# EAGLE design smartIndoor (EAGLE 9.5.2)

## Sheet 1 of 3
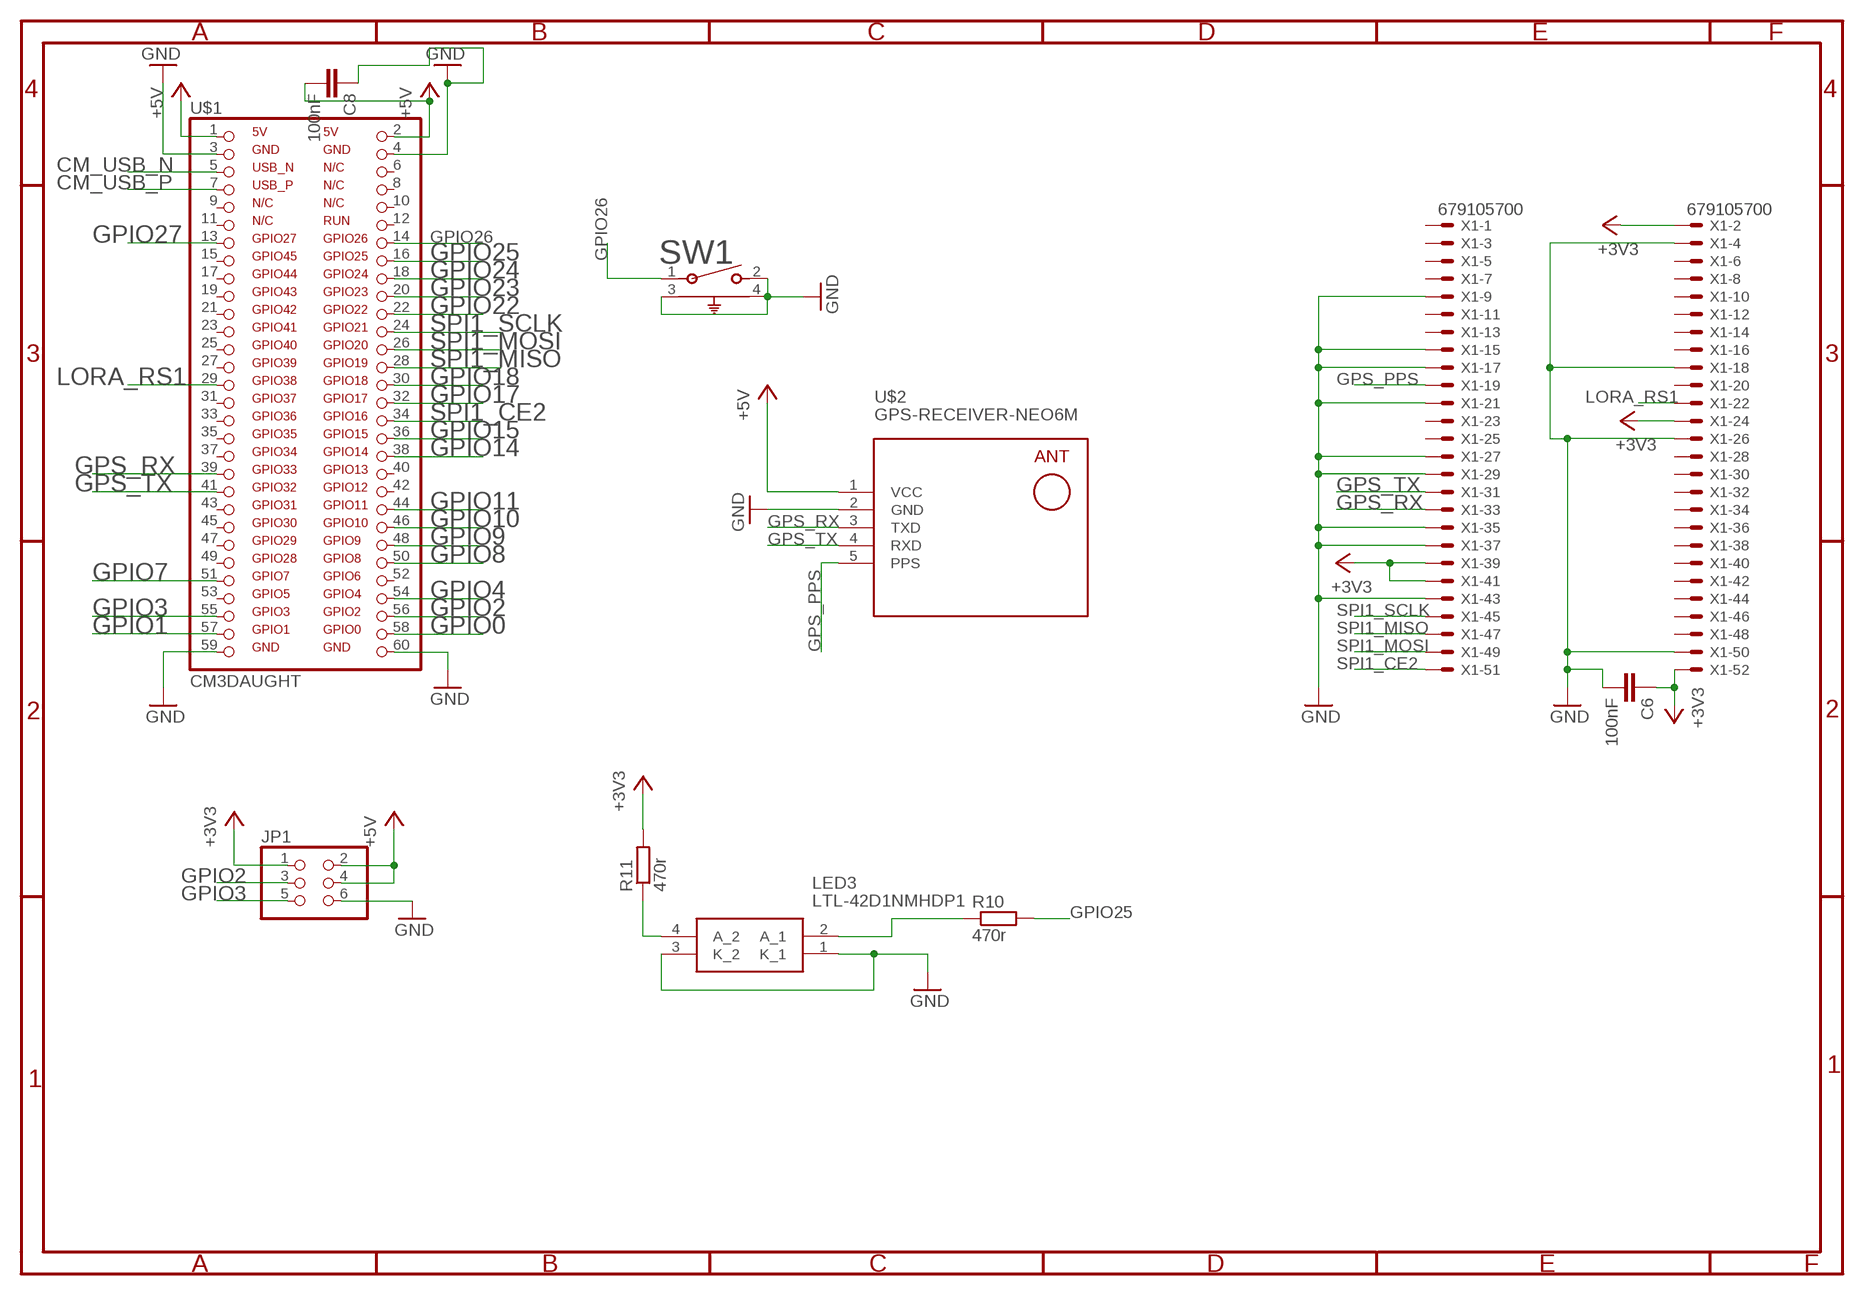
[diagram p0: schematic, sheet 1]

### Parts
C6  100nF  C-EUC0603  [C0603]
C8  100nF  C-EUC0603  [C0603]
JP1  PINHD-2X3  [2X03]
LED3  LTL-42D1NMHDP1  [LTL42D1NMHDP1]
R10  470r  R-EU_R0603  [R0603]
R11  470r  R-EU_R0603  [R0603]
SW1  1825027-8  [SW2_1825027-C_TEC]
U$1  CM3DAUGHT  [2X30]
U$2  GPS-RECEIVER-NEO6M  [GPS-RECEIVER-NEO6M]
X1  679105700  [679105700]

### Nets
+3V3: C6.1 JP1.1 R11.2 X1.2 X1.24 X1.39 X1.41 X1.52 ; also sheet 2
+5V: C8.2 JP1.2 JP1.4 U$1.1(5V) U$1.2(5V) U$2.1(VCC) ; also sheet 2,3
CM_USB_N: U$1.5(USB_N) ; also sheet 3
CM_USB_P: U$1.7(USB_P) ; also sheet 3
GND: C6.2 C8.1 JP1.6 LED3.1(K_1) LED3.3(K_2) SW1.2 SW1.3 SW1.4 U$1.3(GND) U$1.4(GND) U$1.59(GND) U$1.60(GND) U$2.2(GND) X1.4 X1.9 X1.15 X1.17 X1.18 X1.21 X1.26 X1.27 X1.29 X1.35 X1.37 X1.43 X1.50 ; also sheet 2,3
GPIO0: U$1.58(GPIO0)
GPIO1: U$1.57(GPIO1)
GPIO2: JP1.3 U$1.56(GPIO2)
GPIO3: JP1.5 U$1.55(GPIO3)
GPIO4: U$1.54(GPIO4)
GPIO7: U$1.51(GPIO7)
GPIO8: U$1.50(GPIO8)
GPIO9: U$1.48(GPIO9)
GPIO10: U$1.46(GPIO10)
GPIO11: U$1.44(GPIO11)
GPIO14: U$1.38(GPIO14)
GPIO15: U$1.36(GPIO15)
GPIO17: U$1.32(GPIO17)
GPIO18: U$1.30(GPIO18)
GPIO22: U$1.22(GPIO22)
GPIO23: U$1.20(GPIO23)
GPIO24: U$1.18(GPIO24)
GPIO25: R10.2 U$1.16(GPIO25)
GPIO26: SW1.1 U$1.14(GPIO26)
GPIO27: U$1.13(GPIO27)
GPS_PPS: U$2.5(PPS) X1.19
GPS_RX: U$1.39(GPIO33) U$2.3(TXD) X1.33
GPS_TX: U$1.41(GPIO32) U$2.4(RXD) X1.31
LORA_RS1: U$1.29(GPIO38) X1.22
N$6: LED3.4(A_2) R11.1
N$8: LED3.2(A_1) R10.1
SPI1_CE2: U$1.34(GPIO16) X1.51
SPI1_MISO: U$1.28(GPIO19) X1.47
SPI1_MOSI: U$1.26(GPIO20) X1.49
SPI1_SCLK: U$1.24(GPIO21) X1.45
Unconnected: U$1.6 U$1.8 U$1.9 U$1.10 U$1.11 U$1.12 U$1.15(GPIO45) U$1.17(GPIO44) U$1.19(GPIO43) U$1.21(GPIO42) U$1.23(GPIO41) U$1.25(GPIO40) U$1.27(GPIO39) U$1.31(GPIO37) U$1.33(GPIO36) U$1.35(GPIO35) U$1.37(GPIO34) U$1.40(GPIO13) U$1.42(GPIO12) U$1.43(GPIO31) U$1.45(GPIO30) U$1.47(GPIO29) U$1.49(GPIO28) U$1.52(GPIO6) U$1.53(GPIO5) X1.1 X1.3 X1.5 X1.6 X1.7 X1.8 X1.10 X1.11 X1.12 X1.13 X1.14 X1.16 X1.20 X1.23 X1.25 X1.28 X1.30 X1.32 X1.34 X1.36 X1.38 X1.40 X1.42 X1.44 X1.46 X1.48

## Sheet 2 of 3
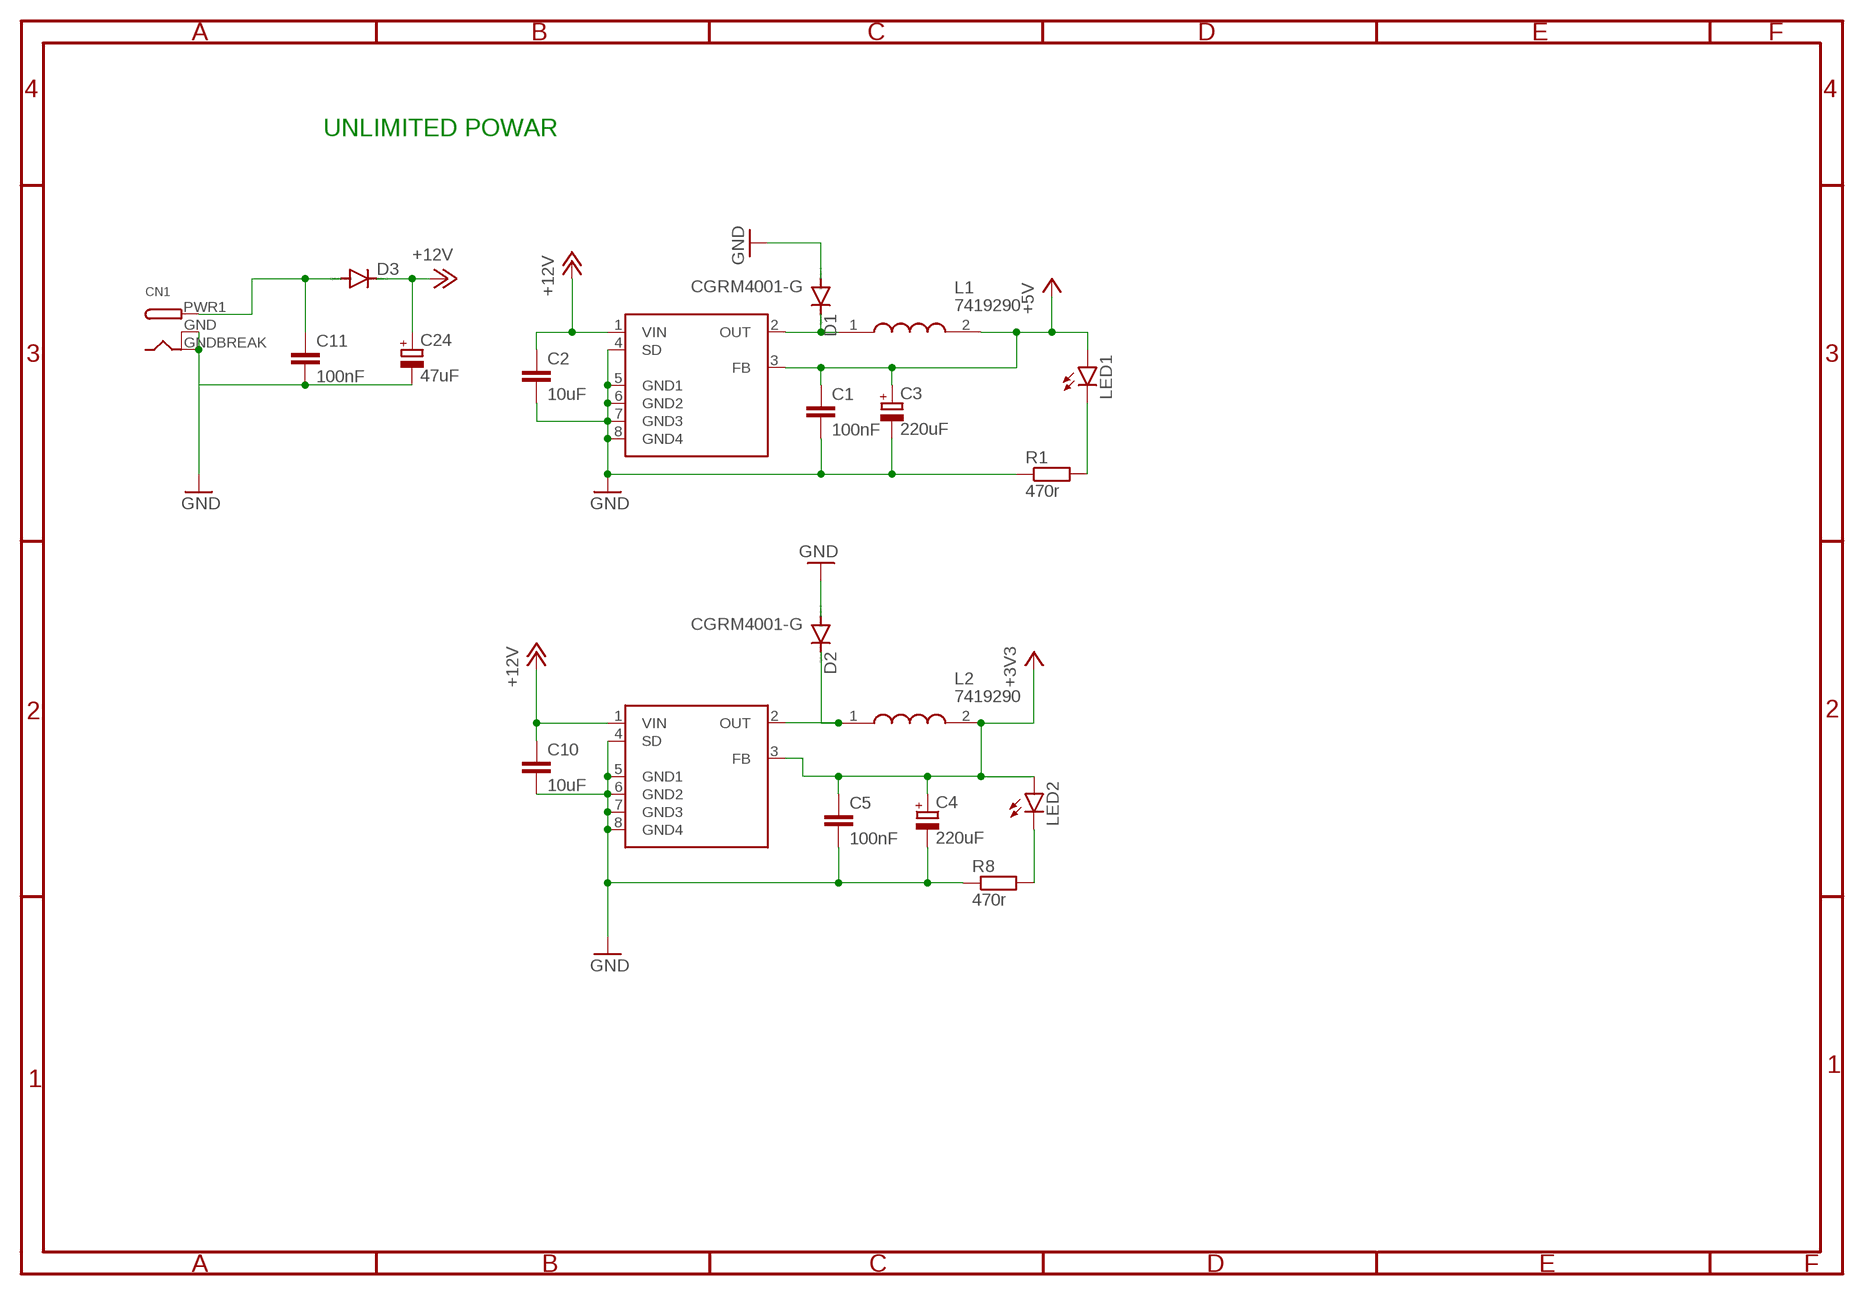
[diagram p1: schematic, sheet 2]

### Parts
C1  100nF  C-EUC0603  [C0603]
C2  10uF  C-EUC0603  [C0603]
C3  220uF  CPOL-EUD  [PANASONIC_D]
C4  220uF  CPOL-EUD  [PANASONIC_D]
C5  100nF  C-EUC0603  [C0603]
C10  10uF  C-EUC0603  [C0603]
C11  100nF  C-EUC0603  [C0603]
C24  47uF  CPOL-EUD  [PANASONIC_D]
CN1  DCBARRELSMT  [DCJACK_2MM_SMT]
D1  CGRM4001-G  [SOD-123_MINI-SMA]
D2  CGRM4001-G  [SOD-123_MINI-SMA]
D3  DIODE-SMB  [SMB]
L1  7419290  [INDPM115100X410N]
L2  7419290  [INDPM115100X410N]
LED1  LEDCHIP-LED0603  [CHIP-LED0603]
LED2  LEDCHIP-LED0603  [CHIP-LED0603]
R1  470r  R-EU_R0603  [R0603]
R8  470r  R-EU_R0603  [R0603]
U1  AP1509  [SO08]
U2  AP1509  [SO08]

### Nets
+3V3: C4.+ C5.1 L2.2 LED2.A U2.3(FB) ; also sheet 1
+5V: C1.1 C3.+ L1.2 LED1.A U1.3(FB) ; also sheet 1,3
+12V: C2.1 C10.1 C24.+ D3.C U1.1(VIN) U2.1(VIN)
GND: C1.2 C2.2 C3.- C4.- C5.2 C10.2 C11.2 C24.- CN1.GND(GNDBREAK) CN1.GNDBREAK(GND) D1.A D2.A R1.1 R8.1 U1.4(SD) U1.5(GND1) U1.6(GND2) U1.7(GND3) U1.8(GND4) U2.4(SD) U2.5(GND1) U2.6(GND2) U2.7(GND3) U2.8(GND4) ; also sheet 1,3
N$5: C11.1 CN1.PWR1(PWR) D3.A
N$7: LED1.C R1.2
N$10: D1.C L1.1 U1.2(OUT)
N$13: LED2.C R8.2
N$14: D2.C L2.1 U2.2(OUT)

### Notes on the sheet
- UNLIMITED POWAR

## Sheet 3 of 3
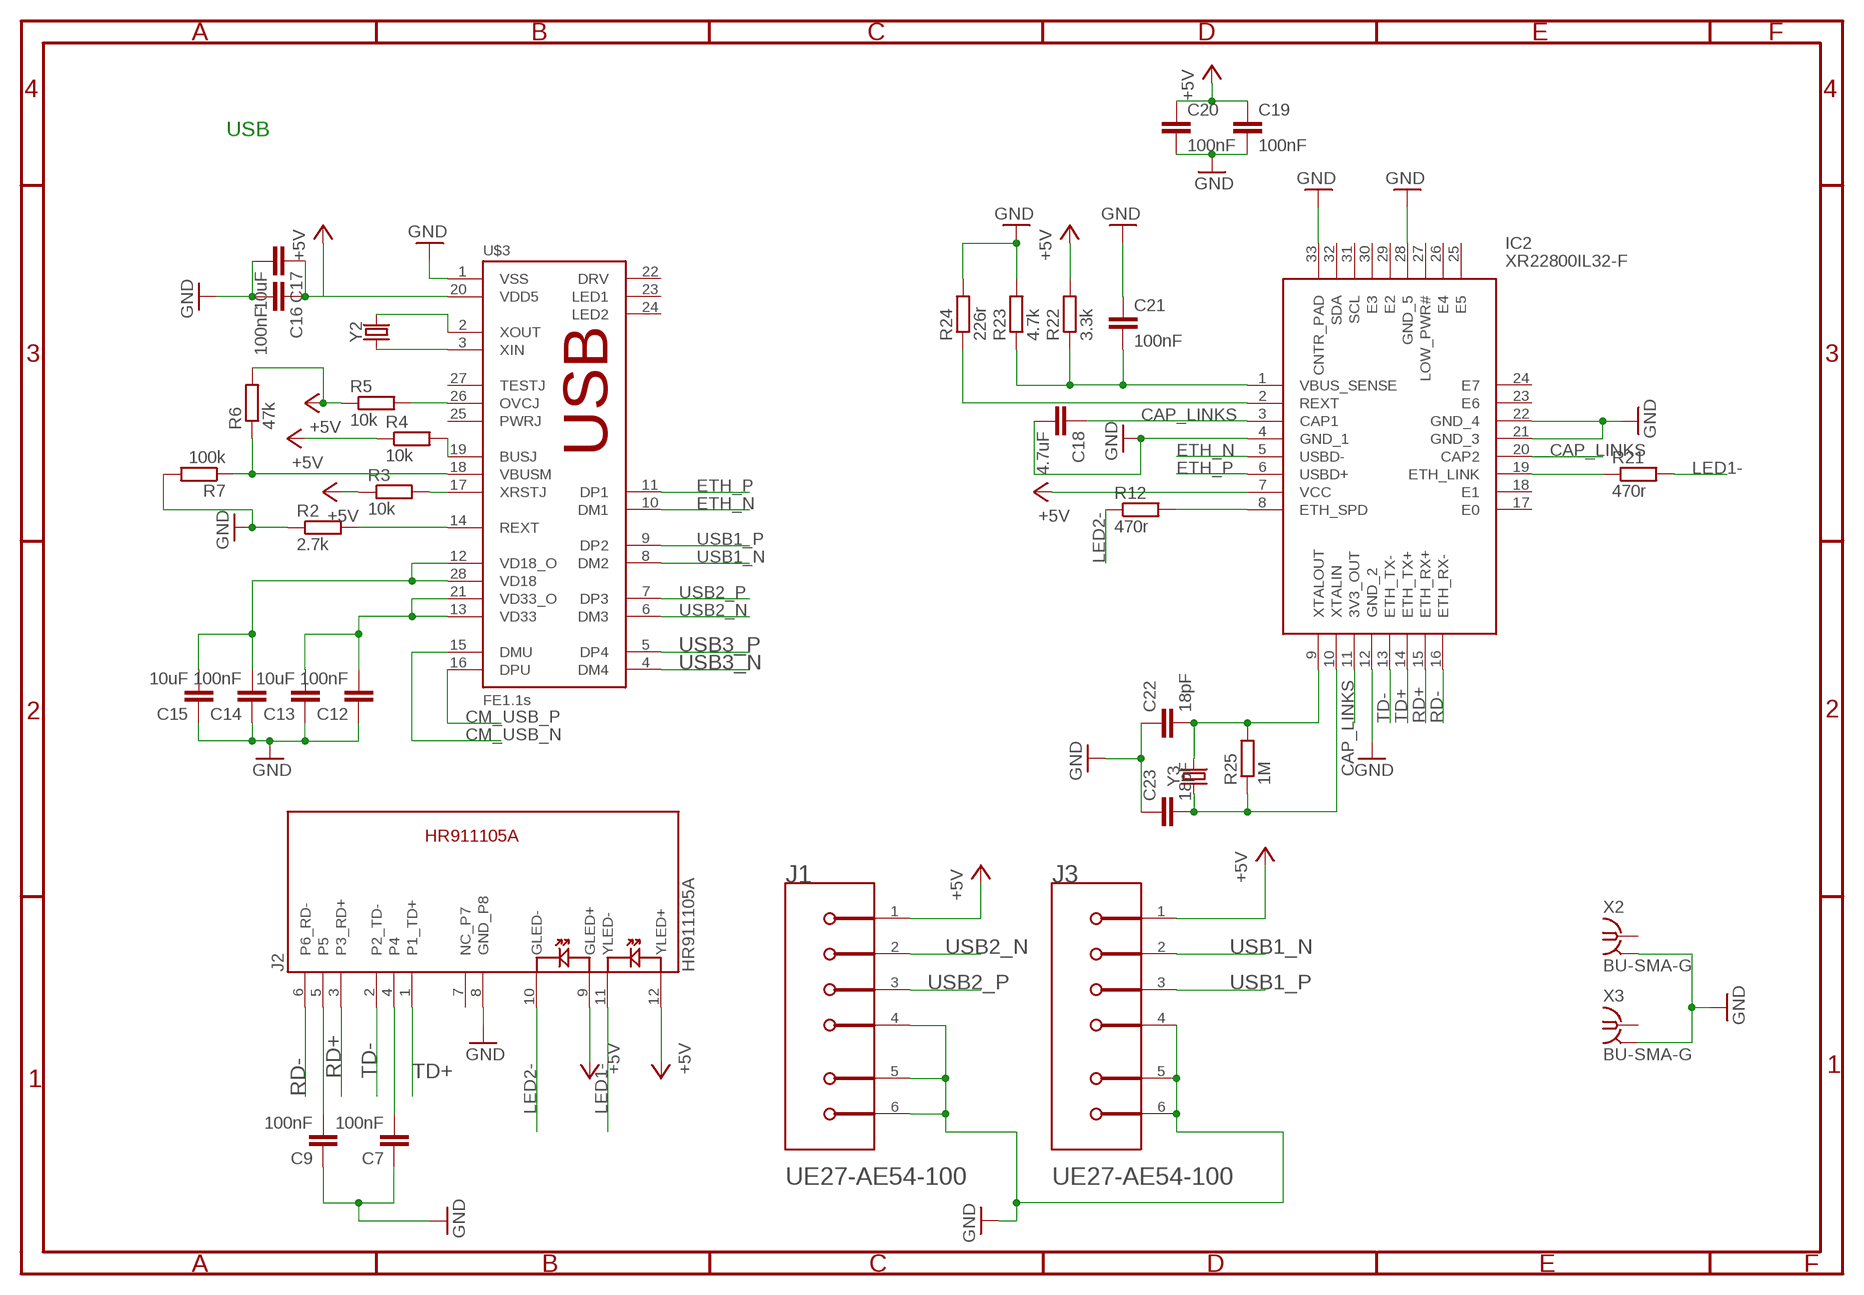
[diagram p2: schematic, sheet 3]

### Parts
C7  100nF  C-EUC0603  [C0603]
C9  100nF  C-EUC0603  [C0603]
C12  100nF  C-EUC0603  [C0603]
C13  10uF  C-EUC0603  [C0603]
C14  100nF  C-EUC0603  [C0603]
C15  10uF  C-EUC0603  [C0603]
C16  100nF  C-EUC0603  [C0603]
C17  10uF  C-EUC0603  [C0603]
C18  4.7uF  C-EUC0603  [C0603]
C19  100nF  C-EUC0603  [C0603]
C20  100nF  C-EUC0603  [C0603]
C21  100nF  C-EUC0603  [C0603]
C22  18pF  C-EUC0603  [C0603]
C23  18pF  C-EUC0603  [C0603]
IC2  XR22800IL32-F  [QFN50P500X500X100-33N]
J1  AMPHENOL_UE27-AE54-100AMPHENOL_UE27-AE54-100_0_0  [AMPHENOL_UE27-AE54-100_0]
J2  HR911105A  [HR911105A]
J3  AMPHENOL_UE27-AE54-100AMPHENOL_UE27-AE54-100_0_0  [AMPHENOL_UE27-AE54-100_0]
R2  2.7k  R-EU_R0603  [R0603]
R3  10k  R-EU_R0603  [R0603]
R4  10k  R-EU_R0603  [R0603]
R5  10k  R-EU_R0603  [R0603]
R6  47k  R-EU_R0603  [R0603]
R7  100k  R-EU_R0603  [R0603]
R12  470r  R-EU_R0603  [R0603]
R21  470r  R-EU_R0603  [R0603]
R22  3.3k  R-EU_R0603  [R0603]
R23  4.7k  R-EU_R0603  [R0603]
R24  226r  R-EU_R0603  [R0603]
R25  1M  R-EU_R0603  [R0603]
U$3  FE1.1S  [FE1.1S_SSOP-28]
X2  BU-SMA-G  [BU-SMA-G]
X3  BU-SMA-G  [BU-SMA-G]
Y2  12mHZ  CRYSTALSMD-HC49UP  [HC49UP]
Y3  25Mhz  CRYSTALSMD-HC49UP  [HC49UP]

### Nets
+5V: C16.1 C17.1 C19.1 C20.1 IC2.7(VCC) J1.1 J2.9(GLED+) J2.12(YLED+) J3.1 R3.1 R4.1 R5.1 R6.2 R22.2 U$3.20(VDD5) ; also sheet 1,2
CAP_LINKS: C18.1 IC2.3(CAP1) IC2.11(3V3_OUT) IC2.20(CAP2)
CM_USB_N: U$3.15(DMU) ; also sheet 1
CM_USB_P: U$3.16(DPU) ; also sheet 1
ETH_N: IC2.5(USBD-) U$3.10(DM1)
ETH_P: IC2.6(USBD+) U$3.11(DP1)
GND: C7.1 C9.1 C12.1 C13.1 C14.1 C15.1 C16.2 C17.2 C18.2 C19.2 C20.2 C21.1 C22.1 C23.1 IC2.4(GND_1) IC2.12(GND_2) IC2.21(GND_3) IC2.22(GND_4) IC2.28(GND_5) IC2.33(CNTR_PAD) J1.4 J1.5(MNT_1) J1.6(MNT_2) J2.8(GND_P8) J3.4 J3.5(MNT_1) J3.6(MNT_2) R2.1 R7.2 R23.2 R24.2 U$3.1(VSS) X2.2 X2.3 X2.4 X2.5 X3.2 X3.3 X3.4 X3.5 ; also sheet 1,2
LED1-: J2.11(YLED-) R21.2
LED2-: J2.10(GLED-) R12.1
N$3: C7.2 J2.4
N$4: C9.2 J2.5
N$11: C12.2 C13.2 U$3.13(VD33) U$3.21(VD33_O)
N$12: C14.2 C15.2 U$3.12(VD18_O) U$3.28(VD18)
N$19: R5.2 U$3.26(OVCJ)
N$20: R2.2 U$3.14(REXT)
N$21: R4.2 U$3.19(BUSJ)
N$22: R6.1 R7.1 U$3.18(VBUSM)
N$24: R3.2 U$3.17(XRSTJ)
N$25: U$3.2(XOUT) Y2.2
N$26: U$3.3(XIN) Y2.1
N$27: IC2.19(ETH_LINK) R21.1
N$37: C23.2 IC2.10(XTALIN) R25.1 Y3.1
N$39: C22.2 IC2.9(XTALOUT) R25.2 Y3.2
N$40: IC2.8(ETH_SPD) R12.2
N$47: IC2.2(REXT) R24.1
N$48: C21.2 IC2.1(VBUS_SENSE) R22.1 R23.1
RD+: IC2.15(ETH_RX+) J2.3(P3_RD+)
RD-: IC2.16(ETH_RX-) J2.6(P6_RD-)
TD+: IC2.14(ETH_TX+) J2.1(P1_TD+)
TD-: IC2.13(ETH_TX-) J2.2(P2_TD-)
USB1_N: J3.2 U$3.8(DM2)
USB1_P: J3.3 U$3.9(DP2)
USB2_N: J1.2 U$3.6(DM3)
USB2_P: J1.3 U$3.7(DP3)
USB3_N: U$3.4(DM4)
USB3_P: U$3.5(DP4)
Unconnected: IC2.17(E0) IC2.18(E1) IC2.23(E6) IC2.24(E7) IC2.25(E5) IC2.26(E4) IC2.27(LOW_PWR#) IC2.29(E2) IC2.30(E3) IC2.31(SCL) IC2.32(SDA) J2.7(NC_P7) U$3.22(DRV) U$3.23(LED1) U$3.24(LED2) U$3.25(PWRJ) U$3.27(TESTJ) X2.1 X3.1

### Notes on the sheet
- USB
- USB

## Library data of the parts
C1 C2 C5-C23 = resistor:C-EU: CAPACITOR, European symbol
C3 C4 C24 = resistor:CPOL-EU: POLARIZED CAPACITOR, European symbol
CN1 = adafruit:DCBARREL: 2.0mm DC Barrel Jack DCJACK_2MM_PTH - Through Hole Jack (4UConnector: 05537)
D1 D2 = diode:CGRM400*-G: Molded plasitc,JEDEC SOD-123/Mini SMA Source: Comchip CGRM4001-G.pdf
D3 = diode:DIODE-: DIODE
IC2 = XR22800IL32-F:XR22800IL32-F: USB Interface IC Hi-Speed USB 10/100 Ethernet Bridge Source: Datasheet <https://www.maxlinear.com/ds/xr22800.pdf>; DESCRIPTION: USB Interface IC Hi-Speed USB 10/100 Ethernet Bridge; HEIGHT: 1mm; MANUFACTURER_NAME: MaxLinear; MANUFACTURER_PART_NUMBER: XR22800IL32-F; MOUSER_PART_NUMBER: 701-22800IL32-F; MOUSER_PRICE-STOCK: https://www.mouser.com/Search/Refine.aspx?Keyword=701-22800IL32-F
J1 J3 = Amphenol - UE27-AE54-100:AMPHENOL_UE27-AE54-100: CONN RCPT USB TYPE A VERT GOLD; CENTROID_NOT_SPECIFIED: No; CONN_ORIENTATION: Vertical; CONTACT_MATERIAL: Gold,Nickel; CURRENT_RATING: 1.5A; DATASHEET: https://signin.amphenolcanada.com/ProductSearch/drawings/AC/UE27AEX4X0X.pdf; DEVICE_CLASS_L1: Connectors; DEVICE_CLASS_L2: USB Connectors; DEVICE_CLASS_L3: unset; DIGIKEY_DESCRIPTION: CONN RCPT USB TYPE A VERT GOLD; DIGIKEY_PART_NUMBER: UE27AE54100-ND; HEIGHT: 14mm; IS_FEMALE: yes; LEAD_FREE: yes; MF: Amphenol; MFG_PACKAGE_IDENT: UE27-AE54-100; MFG_PACKAGE_IDENT_DATE: 0; MFG_PACKAGE_IDENT_REV: 0; MOUSER_DESCRIPTION: CONN RCPT USB TYPE A VERT GOLD; MOUSER_PART_NUMBER: 523-UE27-AE54-100; MPN: UE27-AE54-100; NUMBER_OF_CONTACTS: 4; PACKAGE: PTH_USB_CONN_VERT; PREFIX: J; ROHS: yes; SHIELDING: true; TEMPERATURE_RANGE_HIGH: +85°C; TEMPERATURE_RANGE_LOW: -40°C; USB_STANDARD: USB 2.0; VERIFICATION_VERSION: 0.0.0.1; VOLTAGE_RATING: 250V
J2 = DECADE-libraries20151104:HR911105A: RJ-45 with LEDs
JP1 = pinhead:PINHD-2X3: PIN HEADER
L1 L2 = SamacSys_Parts:7419290: RS Pro NPIS104F Series Shielded Wire-wound SMD Inductor 47 H 20% 1.9A Idc Source: Datasheet <http://docs-europe.electrocomponents.com/webdocs/1581/0900766b81581d01.pdf>; DESCRIPTION: RS Pro NPIS104F Series Shielded Wire-wound SMD Inductor 47 H 20% 1.9A Idc; HEIGHT: 4.1mm; MANUFACTURER_NAME: RS Components; MANUFACTURER_PART_NUMBER: 7419290; RS_PART_NUMBER: 7419290
LED1 LED2 = led:LED: LED OSRAM: - CHIPLED LG R971, LG N971, LY N971, LG Q971, LY Q971, LO R971, LY R971 LH N974, LH R974 LS Q976, LO Q976, LY Q976 LO Q996 - Hyper CHIPLED LW Q18S LB Q993, LB Q99A, LB R99A - SideLED LS A670, LO A670, LY A670, LG A670, LP A670 LB A673, LV A673, LT A673, LW A673 LH A674 LY A675 LS A676, LA A676, LO A676, LY A676, LW A676 LS A679, LY A679, LG A679 - Hyper Micro SIDELED® LS Y876, LA Y876, LO Y876, LY Y876 LT Y87S - SmartLED LW L88C, LW L88S LB L89C, LB L89S, LG L890 LS L89K, LO L89K, LY L89K LS L896, LA L896, LO L896, LY L896 - TOPLED LS T670, LO T670, LY T670, LG T670, LP T670 LSG T670, LSP T670, LSY T670, LOP T670, LYG T670 LG T671, LOG T671, LSG T671 LB T673, LV T673, LT T673, LW T673 LH T674 LS T676, LA T676, LO T676, LY T676, LB T676, LH T676, LSB T676, LW T676 LB T67C, LV T67C, LT T67C, LS T67K, LO T67K, LY T67K, LW E67C LS E67B, LA E67B, LO E67B, LY E67B, LB E67C, LV E67C, LT E67C LW T67C LS T679, LY T679, LG T679 LS T770, LO T770, LY T770, LG T770, LP T770 LB T773, LV T773, LT T773, LW T773 LH T774 LS E675, LA E675, LY E675, LS T675 LS T776, LA T776, LO T776, LY T776, LB T776 LHGB T686 LT T68C, LB T68C - Hyper Mini TOPLED® LB M676 - Mini TOPLED Santana® LG M470 LS M47K, LO M47K, LY M47K Source: http://www.osram.convergy.de LUXEON: - LUMILED® LXK2-PW12-R00, LXK2-PW12-S00, LXK2-PW14-U00, LXK2-PW14-V00 LXK2-PM12-R00, LXK2-PM12-S00, LXK2-PM14-U00 LXK2-PE12-Q00, LXK2-PE12-R00, LXK2-PE12-S00, LXK2-PE14-T00, LXK2-PE14-U00 LXK2-PB12-K00, LXK2-PB12-L00, LXK2-PB12-M00, LXK2-PB14-N00, LXK2-PB14-P00, LXK2-PB14-Q00 LXK2-PR12-L00, LXK2-PR12-M00, LXK2-PR14-Q00, LXK2-PR14-R00 LXK2-PD12-Q00, LXK2-PD12-R00, LXK2-PD12-S00 LXK2-PH12-R00, LXK2-PH12-S00 LXK2-PL12-P00, LXK2-PL12-Q00, LXK2-PL12-R00 Source: www.luxeon.com KINGBRIGHT: KA-3528ASYC Source: www.kingbright.com
LED3 = LTL-42D1NMHDP1:LTL-42D1NMHDP1: LED Circuit Board Indicators Housing LED ThruHole 3mm 2Lvl Grn/Yellow Source: Datasheet <https://datasheet.datasheetarchive.com/originals/distributors/Datasheets-305/79387.pdf>; ARROW_PART_NUMBER: LTL-42D1NMHDP1; ARROW_PRICE-STOCK: https://www.arrow.com/en/products/ltl-42d1nmhdp1/lite-on-technology; DESCRIPTION: LED Circuit Board Indicators Housing LED ThruHole 3mm 2Lvl Grn/Yellow; HEIGHT: 9.6mm; MANUFACTURER_NAME: Lite-On; MANUFACTURER_PART_NUMBER: LTL-42D1NMHDP1; MOUSER_PART_NUMBER: 859-LTL-42D1NMHDP1; MOUSER_PRICE-STOCK: https://www.mouser.co.uk/ProductDetail/Lite-On/LTL-42D1NMHDP1?qs=WxFF5lh7QM1L2xMrizlF%2FQ%3D%3D
R1-R8 R10-R12 R21-R25 = resistor:R-EU_: RESISTOR, European symbol
SW1 = ryanteck:1825027-8; BUILT_BY: EMA_UL_Team; CONFIGURATION__POLE-THROW_: Single Pole - Single Throw; COPYRIGHT: Copyright (C) 2016 Accelerated Designs. All rights reserved; DESCRIPTION: FSMRA3JH04=R/A,TACT PB SW,160G; MANUFACTURER_PART_NUMBER: 1825027-8; MAX_SWITCHING_CURRENT: -; MAX_SWITCHING_VOLTAGE_AC_: -; PRODUCT_TYPE: Switch; SOURCELIBRARY: TE_Connectivity-2018-03-16; SWITCH_TYPE: Tactile Switches; TE_PART_NUMBER: 1825027-8; VENDOR: TE Connectivity
U1 U2 = bt_regulator:AP1509: AP1509, 150KHz, 2A PWM BUCK DC/DC CONVERTER The AP1509 series are monolithic IC designed for a stepdown DC/DC converter, and own the ability of driving a 2A load without additional transistor. Datasheet.pdf <http://www.diodes.com/_files/datasheets/AP1509.pdf>
U$1 = ryanteck:CM3DAUGHT
U$2 = diy-modules:GPS-RECEIVER-NEO6M: GPS Receiver Module based on NEO-6 device Short tutorial how to use NEO-6 module with Arduino: http://www.xarg.org/2016/06/neo6mv2-gps-module-with-arduino/ NEO-6 datasheet is available here: https://www.u-blox.com/sites/default/files/products/documents/NEO-6_DataSheet_%28GPS.G6-HW-09005%29.pdf Click here to find device on ebay.com <http://www.ebay.com/sch/gyneo6mv2>
U$3 = Ai_IC:FE1.1S
X1 = con-molex:679105700: MINI PCI EXPRESS CONNECTOR 0.8MM PITCH, 52 CIRCUIT Source: http://www.molex.com/pdm_docs/sd/679105700_sd.pdf; MPN: 67910-5700; OC_FARNELL: unknown; OC_NEWARK: 93M2128
X2 X3 = con-coax:BU-SMA-G: FEMALE SMA CONNECTOR Radiall distributor RS 193-9117; OC_FARNELL: unknown; OC_NEWARK: unknown
Y2 Y3 = SparkFun-Clocks:CRYSTAL: Crystals (Generic) These are passive quartz crystals, which can be used as a clock source for a microcontroller. Crystal's are two-terminal devices. They require external "load" capacitors to generate an oscillating signal.

## Board
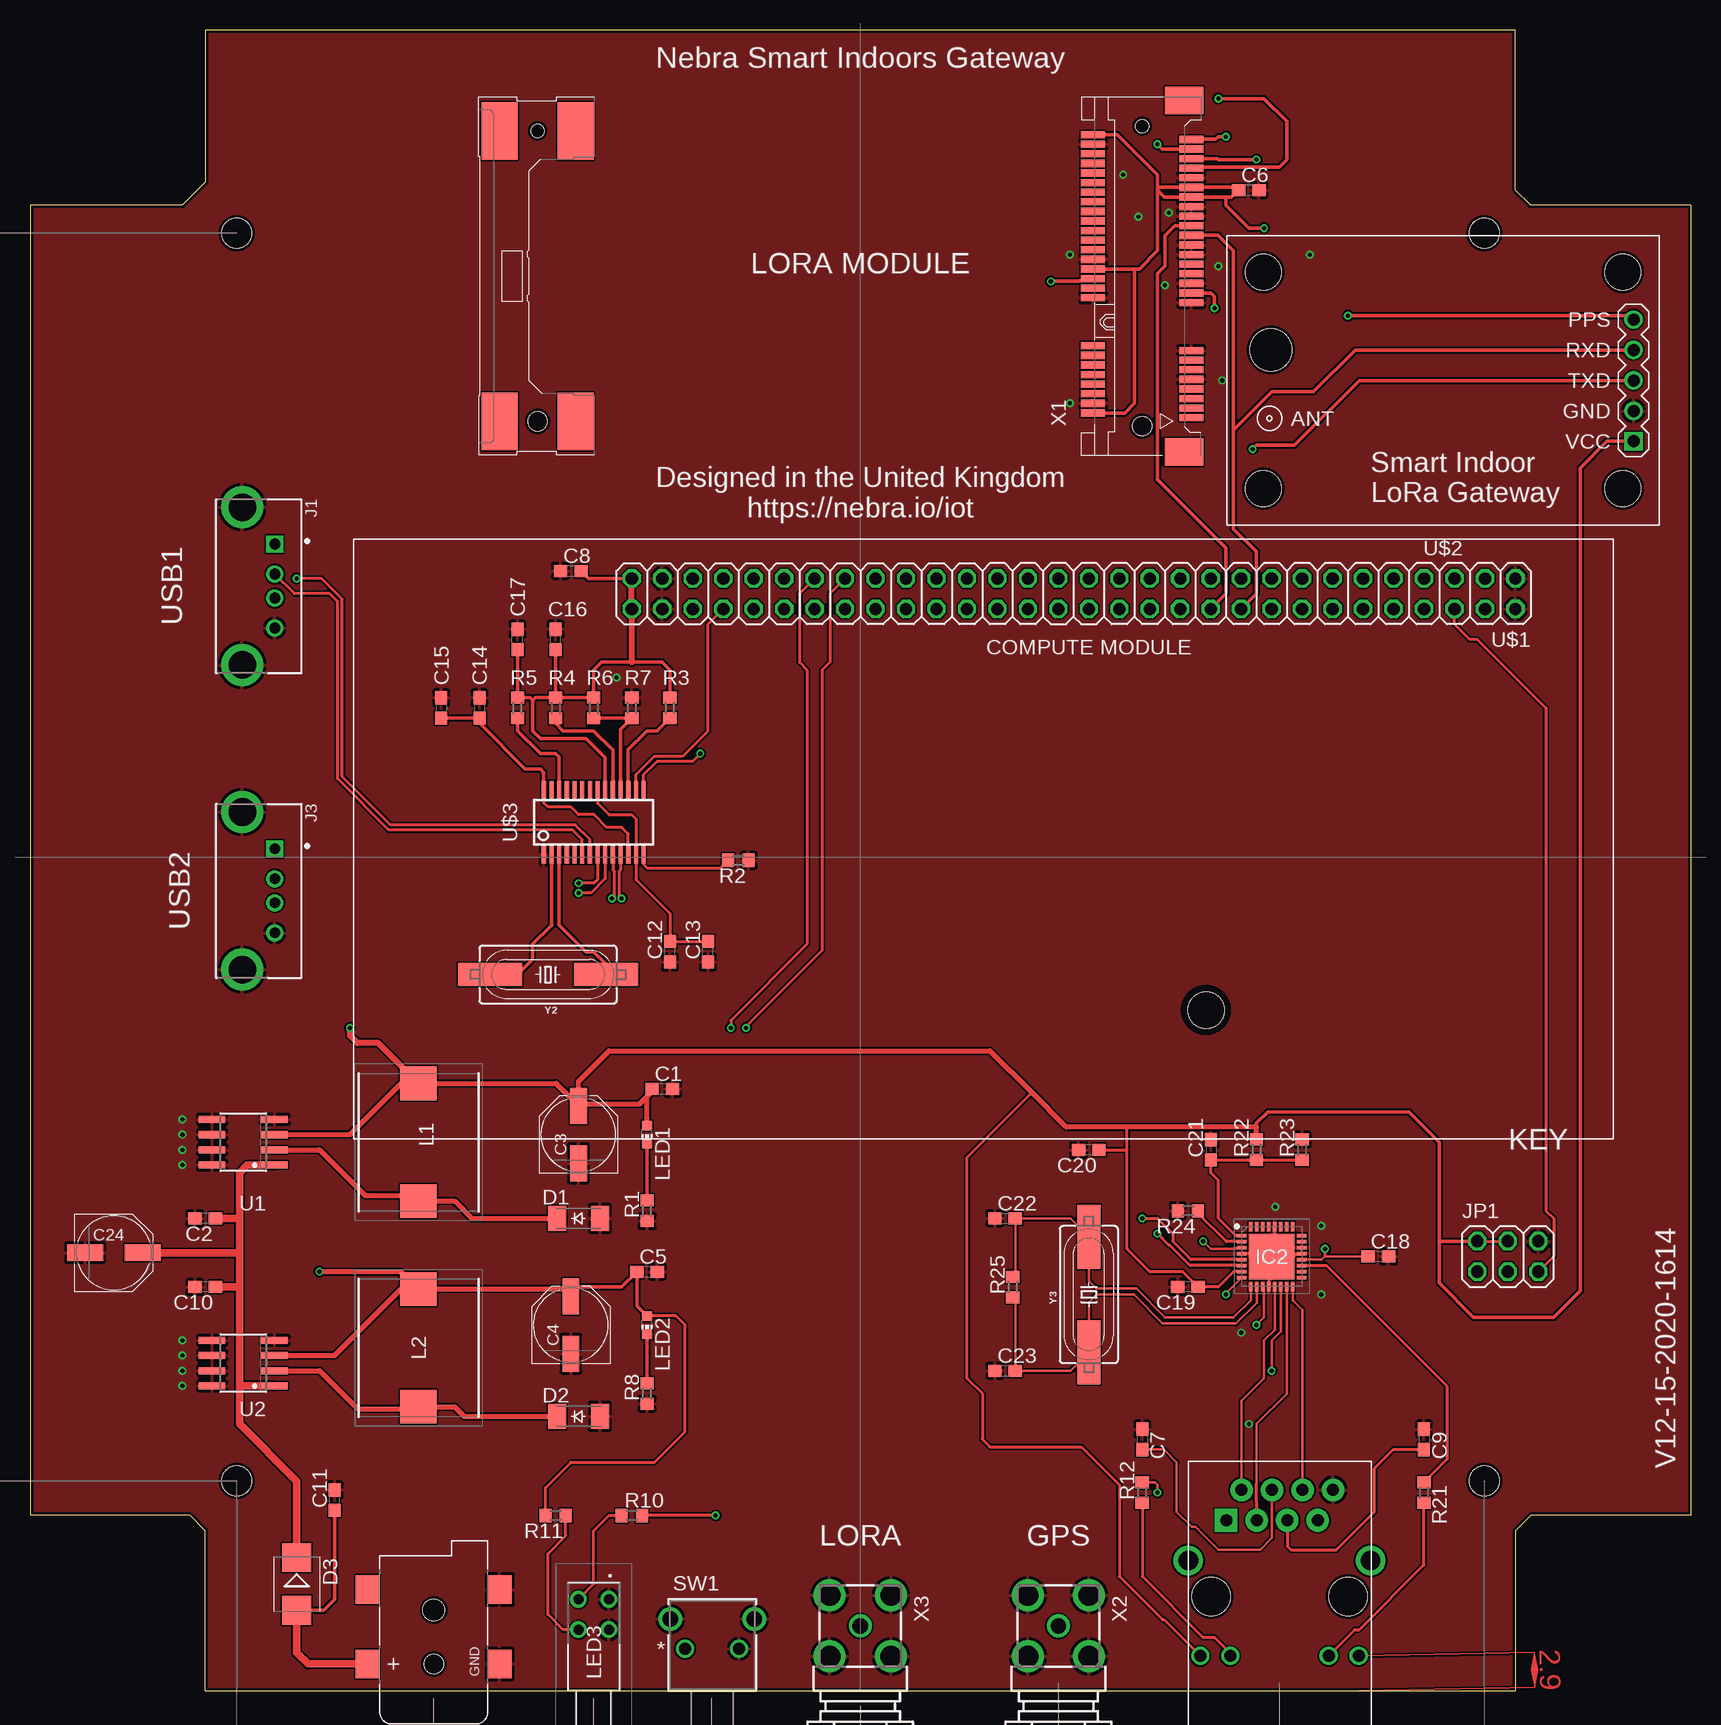
[diagram p3: board, top side]
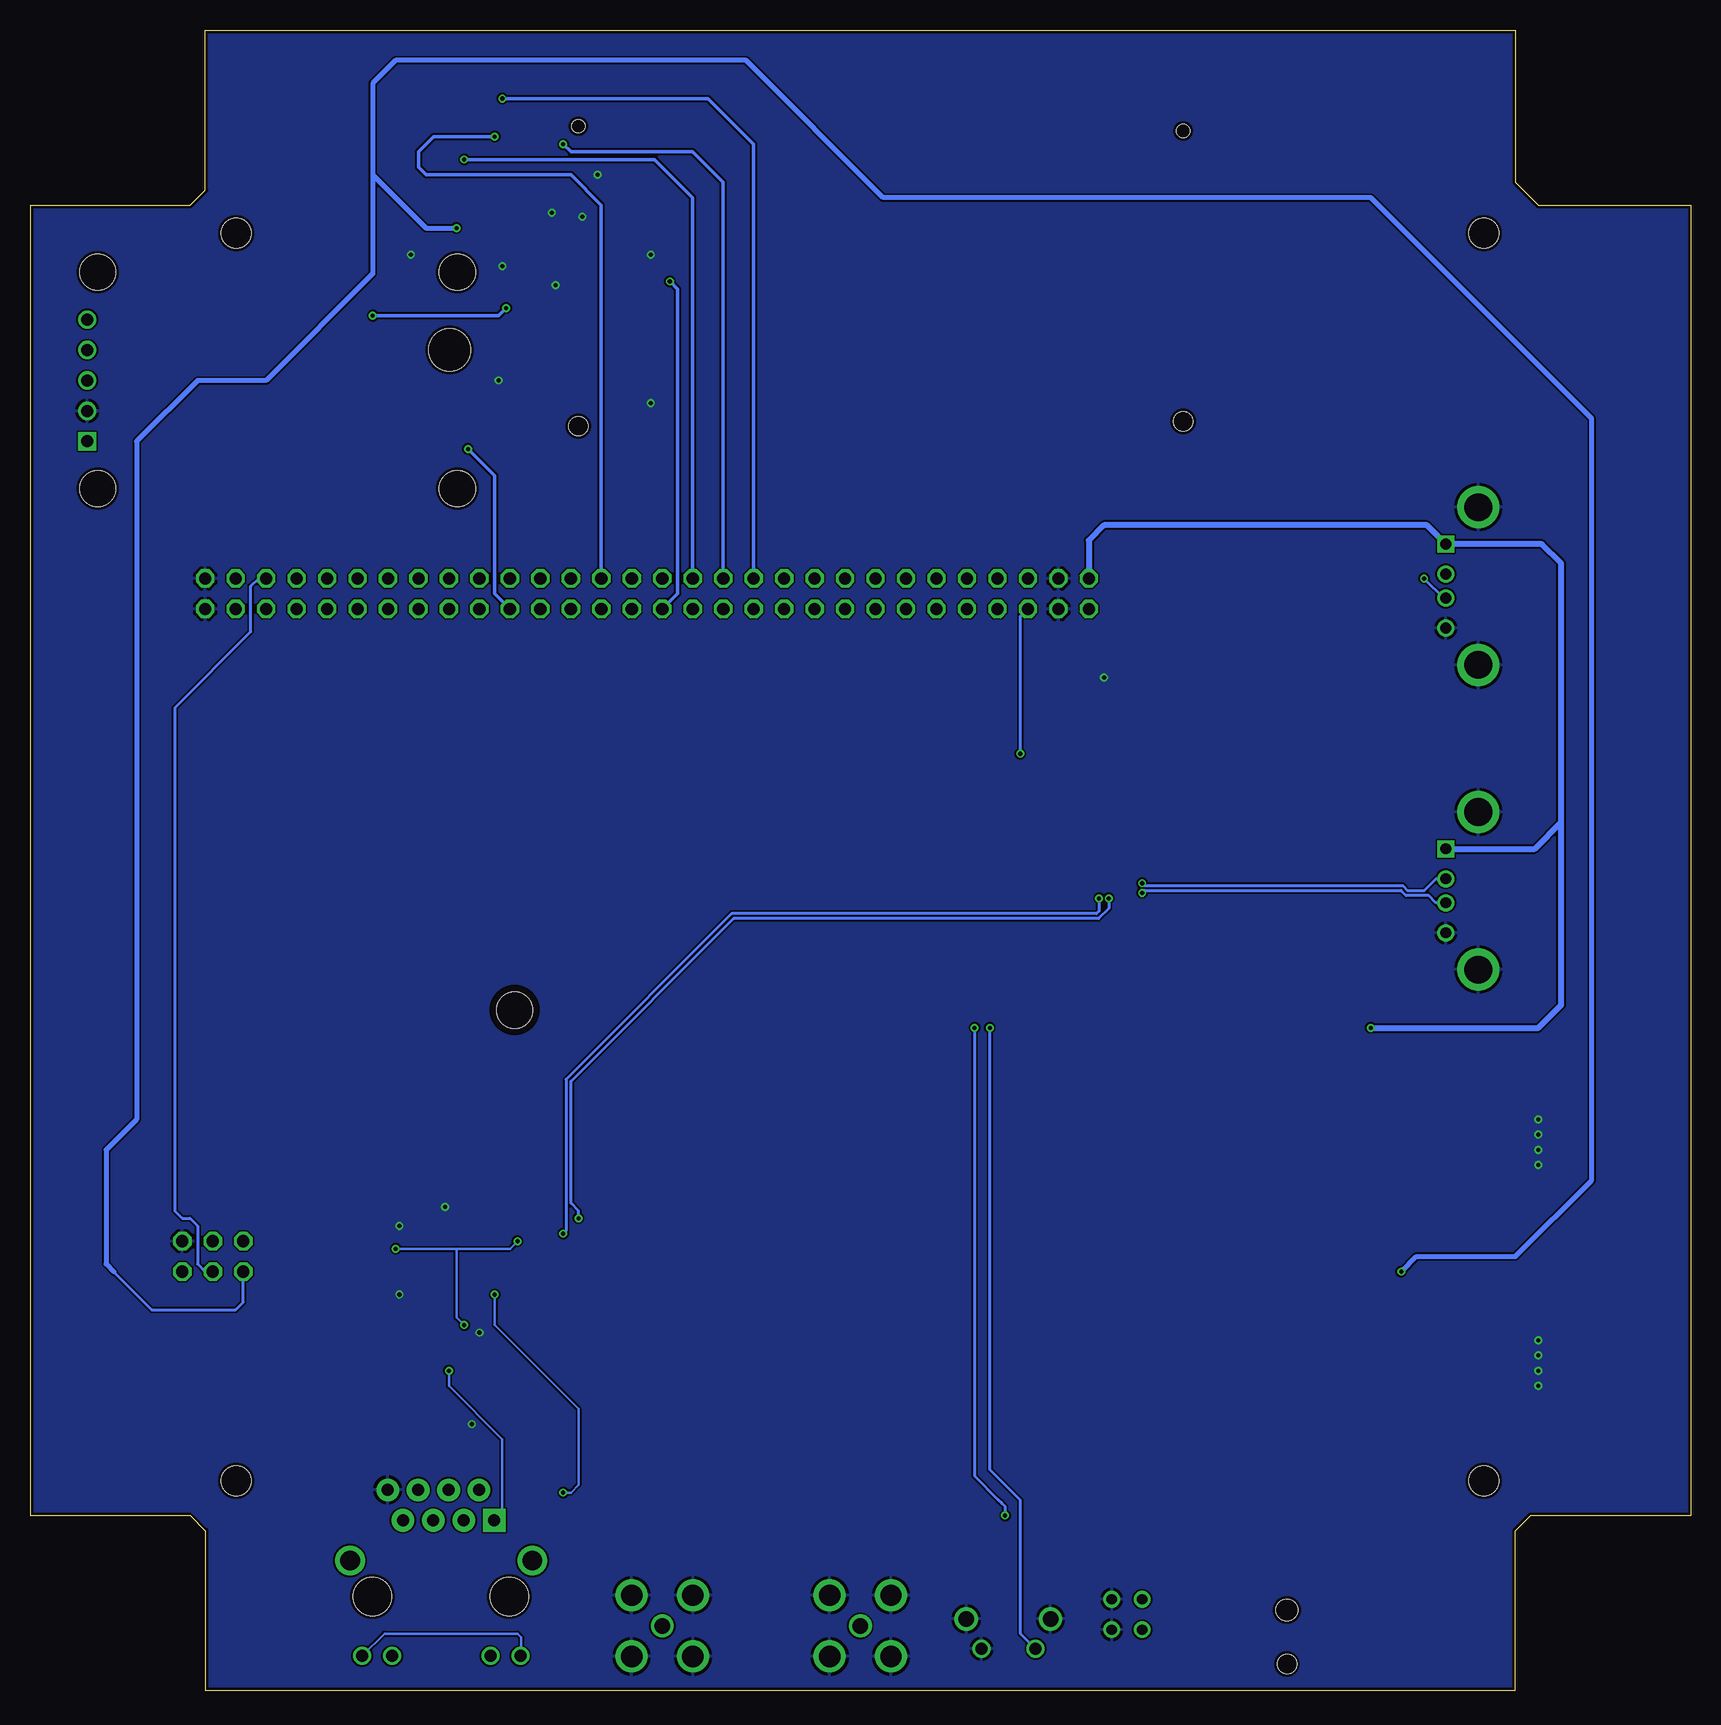
[diagram p4: board, bottom side, seen from below]

Size 138.43 x 138.43 mm. Coordinates in mm from the lower left corner, seen from the top.
Outline: 14.61,0 123.83,0 123.83,13.34 125.09,14.61 138.43,14.61 138.43,123.83 125.09,123.83 123.83,125.09 123.83,138.43 14.61,138.43 14.61,125.73 12.7,123.83 0,123.83 0,14.61 13.34,14.61 14.61,13.34 14.61,0
Copper layers (1*16): Top 0.035mm / dielectric 1.5mm / Bottom 0.035mm
Design rules "dirt_cheap_dirty_boards.v1.1": minimum track width 6mil, minimum drill 12mil, track to track 6mil, track to pad 6mil, pad to pad 6mil, via to via 6mil, smd to smd 0mil, copper to edge 10mil, drill to drill 10mil, minimum pad ring 10mil, minimum via ring 6mil, stop-mask expansion 2mil, vias tented up to drill 25mil, thermal gap 10mil
Holes 2.5 mm at 17.23,17.5 17.23,121.5 121.23,121.5 121.23,17.5

### Footprints (pad centres in the part's own frame; a part is rotated, then mirrored left to right if it is on the bottom)
C0603 = smd 1.1 x 1: 1 -0.85,0; 2 0.85,0
PANASONIC_D = smd 3 x 1.4: + 2.4,0; - -2.4,0
DCJACK_2MM_SMT = smd 2.4 x 2: GND 0,-5.5; GNDBREAK 6.2,-5.5; PWR1 0,5.5; PWR2 6.2,5.5 | hole 1.6: 0,0 | hole 1.8: 4.5,0
SOD-123_MINI-SMA = smd 1.5 x 2.1: A 1.8,0; C -1.8,0
SMB = smd 2.4 x 2.4: A 2.2,0; C -2.2,0
QFN50P500X500X100-33N = smd 0.8 x 0.3: 1 -2.5,1.75; 2 -2.5,1.25; 3 -2.5,0.75; 4 -2.5,0.25; 5 -2.5,-0.25; 6 -2.5,-0.75; 7 -2.5,-1.25; 8 -2.5,-1.75; 17 2.5,-1.75; 18 2.5,-1.25; 19 2.5,-0.75; 20 2.5,-0.25; 21 2.5,0.25; 22 2.5,0.75; 23 2.5,1.25; 24 2.5,1.75 | smd 0.3 x 0.8: 9 -1.75,-2.5; 10 -1.25,-2.5; 11 -0.75,-2.5; 12 -0.25,-2.5; 13 0.25,-2.5; 14 0.75,-2.5; 15 1.25,-2.5; 16 1.75,-2.5; 25 1.75,2.5; 26 1.25,2.5; 27 0.75,2.5; 28 0.25,2.5; 29 -0.25,2.5; 30 -0.75,2.5; 31 -1.25,2.5; 32 -1.75,2.5 | smd 3.8 x 3.8: 33 0,0
AMPHENOL_UE27-AE54-100_0 = drill 0.9 pad 1.4 square: 1 -3.5,1.36 | drill 0.9 pad 1.4: 2 -1,1.36; 3 1,1.36; 4 3.5,1.36 | drill 2.3 pad 3.5: 5 -6.57,-1.35; 6 6.57,-1.35
HR911105A = drill 1 pad 1.88 square: 1 5.05,2.485 | drill 1 pad 1.88: 2 3.78,-0.055; 3 2.51,2.485; 4 1.24,-0.055; 5 -0.03,2.485; 6 -1.3,-0.055; 7 -2.57,2.485; 8 -3.84,-0.055 | drill 1 pad 1.27: 9 7.225,13.79; 10 4.725,13.79; 11 -3.475,13.79; 12 -5.975,13.79 | drill 1.65 pad 2.184: M1 8.225,5.84; M2 -6.975,5.84 | hole 3.2: 6.32,8.835; -5.11,8.835
2X03 = drill 1.016 octagon: 1 -2.54,-1.27; 2 -2.54,1.27; 3 0,-1.27; 4 0,1.27; 5 2.54,-1.27; 6 2.54,1.27
INDPM115100X410N = smd 2.8 x 3.05: 1 -4.9,0; 2 4.9,0
CHIP-LED0603 = smd 0.8 x 0.8: A 0,-0.75; C 0,0.75
LTL42D1NMHDP1 = drill 0.85 pad 1.381: 1 0,0; 2 0,2.54; 3 -2.54,0; 4 -2.54,2.54
R0603 = smd 1 x 1.1: 1 -0.85,0; 2 0.85,0
SW2_1825027-C_TEC = drill 0.991 pad 1.499: 1 0,0; 2 4.496,0 | drill 1.295 pad 1.803: 3 -1.245,2.489; 4 5.766,2.489
SO08 = smd 0.6 x 2.2: 1 -1.905,-2.6; 2 -0.635,-2.6; 3 0.635,-2.6; 4 1.905,-2.6; 5 1.905,2.6; 6 0.635,2.6; 7 -0.635,2.6; 8 -1.905,2.6
2X30 = drill 1.016 octagon: 1 -38.1,-1.27; 2 -38.1,1.27; 3 -35.56,-1.27; 4 -35.56,1.27; 5 -33.02,-1.27; 6 -33.02,1.27; 7 -30.48,-1.27; 8 -30.48,1.27; 9 -27.94,-1.27; 10 -27.94,1.27; 11 -25.4,-1.27; 12 -25.4,1.27; 13 -22.86,-1.27; 14 -22.86,1.27; 15 -20.32,-1.27; 16 -20.32,1.27; 17 -17.78,-1.27; 18 -17.78,1.27; 19 -15.24,-1.27; 20 -15.24,1.27; 21 -12.7,-1.27; 22 -12.7,1.27; 23 -10.16,-1.27; 24 -10.16,1.27; 25 -7.62,-1.27; 26 -7.62,1.27; 27 -5.08,-1.27; 28 -5.08,1.27; 29 -2.54,-1.27; 30 -2.54,1.27; 31 0,-1.27; 32 0,1.27; 33 2.54,-1.27; 34 2.54,1.27; 35 5.08,-1.27; 36 5.08,1.27; 37 7.62,-1.27; 38 7.62,1.27; 39 10.16,-1.27; 40 10.16,1.27; 41 12.7,-1.27; 42 12.7,1.27; 43 15.24,-1.27; 44 15.24,1.27; 45 17.78,-1.27; 46 17.78,1.27; 47 20.32,-1.27; 48 20.32,1.27; 49 22.86,-1.27; 50 22.86,1.27; 51 25.4,-1.27; 52 25.4,1.27; 53 27.94,-1.27; 54 27.94,1.27; 55 30.48,-1.27; 56 30.48,1.27; 57 33.02,-1.27; 58 33.02,1.27; 59 35.56,-1.27; 60 35.56,1.27 | hole 3: 9.77,-34.71
GPS-RECEIVER-NEO6M = drill 1 square: 1 -15.875,5.08 | drill 1: 2 -15.875,2.54; 3 -15.875,0; 4 -15.875,-2.54; 5 -15.875,-5.08 | hole 3: -14.986,9.017; -14.986,-9.017; 14.986,-9.017; 14.986,9.017 | hole 3.5: 14.351,-2.54
FE1.1S_SSOP-28 = smd 0.35 x 1.5: 1 -4.16,-2.7; 2 -3.52,-2.7; 3 -2.88,-2.7; 4 -2.24,-2.7; 5 -1.6,-2.7; 6 -0.96,-2.7; 7 -0.32,-2.7; 8 0.32,-2.7; 9 0.96,-2.7; 10 1.6,-2.7; 11 2.24,-2.7; 12 2.88,-2.7; 13 3.52,-2.7; 14 4.16,-2.7; 15 4.16,2.7; 16 3.52,2.7; 17 2.88,2.7; 18 2.24,2.7; 19 1.6,2.7; 20 0.96,2.7; 21 0.32,2.7; 22 -0.3,2.7; 23 -0.96,2.7; 24 -1.6,2.7; 25 -2.24,2.7; 26 -2.88,2.7; 27 -3.52,2.7; 28 -4.16,2.7
679105700 = smd 0.6 x 2: 1 0.7,-4.1; 2 1.1,4.1; 3 1.5,-4.1; 4 1.9,4.1; 5 2.3,-4.1; 6 2.7,4.1; 7 3.1,-4.1; 8 3.5,4.1; 9 3.9,-4.1; 10 4.3,4.1; 11 4.7,-4.1; 12 5.1,4.1; 13 5.5,-4.1; 14 5.9,4.1; 15 6.3,-4.1; 16 6.7,4.1; 17 10.3,-4.1; 18 10.7,4.1; 19 11.1,-4.1; 20 11.5,4.1; 21 11.9,-4.1; 22 12.3,4.1; 23 12.7,-4.1; 24 13.1,4.1; 25 13.5,-4.1; 26 13.9,4.1; 27 14.3,-4.1; 28 14.7,4.1; 29 15.1,-4.1; 30 15.5,4.1; 31 15.9,-4.1; 32 16.3,4.1; 33 16.7,-4.1; 34 17.1,4.1; 35 17.5,-4.1; 36 17.9,4.1; 37 18.3,-4.1; 38 18.7,4.1; 39 19.1,-4.1; 40 19.5,4.1; 41 19.9,-4.1; 42 20.3,4.1; 43 20.7,-4.1; 44 21.1,4.1; 45 21.5,-4.1; 46 21.9,4.1; 47 22.3,-4.1; 48 22.7,4.1; 49 23.1,-4.1; 50 23.5,4.1; 51 23.9,-4.1; 52 24.3,4.1 | smd 2.3 x 3.2: M1 27.15,-3.5; M2 -2.15,-3.5 | smd 4.8 x 3: M3 0.4,47.25; M4 0.4,53.55; M5 24.6,47.25; M6 24.6,53.55 | hole 1.6: 0,0; 0.4,50.4 | hole 1.1: 25,0; 24.6,50.4
BU-SMA-G = drill 1.27: 1 0,0 | drill 1.778: 2 -2.55,2.55; 3 2.55,2.55; 4 2.55,-2.55; 5 -2.55,-2.55
HC49UP = smd 5.334 x 1.93: 1 -4.826,0; 2 4.826,0

### Placement (x,y rotation side)
C1  52.7,50.16 0 top
C2  14.61,39.37 180 top
C3  45.72,46.35 90 top
C4  45.08,30.48 90 top
C5  51.43,34.92 0 top
C6  101.6,125.09 0 top
C7  92.71,20.95 270 top
C8  45.08,93.34 0 top
C9  116.2,20.95 270 top
C10  14.61,33.66 180 top
C11  25.4,15.88 90 top
C12  53.34,61.59 90 top
C13  56.51,61.59 90 top
C14  37.46,81.92 270 top
C15  34.29,81.92 270 top
C16  43.81,87.63 90 top
C17  40.64,87.63 90 top
C18  112.4,36.2 0 top
C19  96.52,33.66 180 top
C20  88.27,45.09 180 top
C21  98.42,45.09 270 top
C22  81.28,39.37 0 top
C23  81.28,26.67 0 top
C24  6.99,36.51 0 top
CN1  33.65,2.22 90 top
D1  45.72,39.37 0 top
D2  45.72,22.86 0 top
D3  22.23,8.89 270 top
IC2  103.51,36.2 0 top
J1  19.05,92.08 270 top
J2  104.78,16.68 180 top
J3  19.05,66.67 270 top
JP1  123.19,36.2 0 top
L1  32.38,45.72 90 top
L2  32.38,28.57 90 top
LED1  51.43,46.35 180 top
LED2  51.43,30.48 180 top
LED3  48.26,7.62 90 top
R1  51.43,40.01 90 top
R2  59.05,69.22 180 top
R3  53.34,81.92 270 top
R4  43.81,81.92 270 top
R5  40.64,81.92 270 top
R6  46.99,81.92 90 top
R7  50.16,81.92 90 top
R8  51.43,24.77 90 top
R10  50.16,14.61 0 top
R11  43.81,14.61 180 top
R12  92.71,16.51 90 top
R21  116.2,16.51 270 top
R22  102.23,45.09 90 top
R23  106.05,45.09 90 top
R24  96.52,40.01 180 top
R25  81.92,33.66 90 top
SW1  54.61,3.49 0 top
U1  17.78,45.72 90 top
U2  17.78,27.3 90 top
U$1  88.27,91.44 0 top
U$2  117.79,109.22 180 top
U$3  46.99,72.39 0 top
X1  92.71,105.41 90 top
X2  85.73,5.4 270 top
X3  69.22,5.4 270 top
Y2  43.18,59.69 180 top
Y3  88.27,33.02 90 top

### Tracks (layer width: path | path; a pad name or v marks a point on that pad's centre or on a via)
+3V3  (via drill 0.35)
  Top 0.254: R11.2 42.96,16.93 45.08,19.05 52.07,19.05 54.61,21.59 54.61,30.48 53.86,31.23 LED2.A
  Top 0.305: C4.+ 45.86,33.66 49.31,33.66 C5.1 50.58,32.08 LED2.A | 93.98,125.09 94.56,124.51 X1.39 99.7,124.51 | 93.98,125.09 94.2,125.31 X1.41 100.54,125.31 C6.1 100.17,124.51 99.7,124.51 | X1.52 90.64,129.71 93.98,126.36 93.98,125.09 | X1.24 92.08,118.51 | 92.08,118.51 92.48,118.51 93.98,120.02 93.98,125.09 | X1.2 91.27,106.51 92.08,107.31 92.08,118.51 | 99.7,124.51 99.7,123.83 101.6,121.92 v102.87,121.92
  Top 0.406: U2.3 25.4,27.94 30.93,33.48 L2.2 | L2.2 44.49,33.48 C4.+ | L2.2 30.93,34.92 v24.13,34.92
  Bottom 0.254: 131.44,34.92 128.27,31.75 121.29,31.75 120.65,32.38 JP1.1
  Bottom 0.406: v24.13,34.92 22.86,36.2 14.61,36.2 8.26,42.55 8.26,106.05 26.67,124.46 67.31,124.46 78.74,135.89 107.95,135.89 109.86,133.99 109.86,126.36 | v102.87,121.92 105.41,121.92 109.86,126.36 | 109.86,126.36 109.86,118.11 118.75,109.22 124.46,109.22 129.54,104.14 129.54,47.62 132.08,45.09 132.08,35.56 131.44,34.92
+5V  (via drill 0.35)
  Top 0.254: IC2.7 100.35,34.95 99.06,33.66 C19.1 96.1,34.92 93.34,34.92 91.44,36.83 91.44,45.09 | 91.44,45.09 91.44,46.99 | C20.1 91.44,45.09 | 83.5,49.85 78.11,44.45 78.11,26.04 79.38,24.77 79.38,20.95 80.01,20.32 87.63,20.32 90.81,17.14 90.81,9.53 94.44,5.89 94.55,5.89 J2.9 | JP1.2 JP1.4
  Top 0.305: U$3.20 47.95,77.78 46.35,79.38 42.54,79.38 41.91,80.01 41.91,82.55 | 41.91,82.55 41.7,82.77 R5.1 C17.1 | 41.91,82.55 42.12,82.77 R4.1 | R4.1 R6.2 46.99,85.09 47.62,85.72 50.16,85.72 52.7,85.72 53.34,85.09 R3.1 | C16.1 R4.1 | U$1.2 46.57,92.71 C8.2 | 102.23,46.99 102.23,47.31 103.19,48.26 114.94,48.26 117.48,45.72 117.48,37.47 | 117.48,37.47 117.48,33.97 120.33,31.11 127,31.11 129.22,33.34 129.22,101.92 131.44,104.14 U$2.1 | JP1.2 117.48,37.47
  Top 0.406: C3.+ 43.85,50.62 L1.2 30.93,50.62 26.67,46.35 U1.3 | C3.+ 45.86,48.9 50.8,48.9 51.43,49.53 | C1.1 51.85,49.95 51.43,49.53 | LED1.A 51.43,49.53 | C3.+ 45.72,50.8 48.26,53.34 80.01,53.34 83.5,49.85 86.36,46.99 91.44,46.99 102.23,46.99 R22.2
  Top 0.508: U$1.2 U$1.1 50.16,85.72 | L1.2 29.03,53.98 27.3,53.98 26.67,54.61 v26.67,55.24
  Bottom 0.203: J2.12 108.88,4.76 97.79,4.76 97.47,4.45 97.47,2.97 J2.9
  Bottom 0.508: U$1.2 50.16,95.89 48.89,97.16 21.99,97.16 J1.1 12.39,95.58 10.79,93.98 10.79,72.39 | v26.67,55.24 12.7,55.24 10.79,57.15 10.79,72.39 | J3.1 13.01,70.17 10.79,72.39
+12V
  Top 0.61: D3.C 22.23,17.46 17.46,22.23 17.46,25.4 | U1.1 18.1,43.81 17.46,43.18 17.46,39.37 | 17.46,25.4 17.46,33.66 | 17.46,33.66 17.46,36.51 | 17.46,36.51 17.46,39.37 | U2.1 17.46,25.4 | C10.1 17.46,33.66 | C2.1 17.46,39.37 | C24.+ 17.46,36.51
CAP_LINKS  (via drill 0.35)
  Top 0.203: IC2.20 107.7,35.95 107.95,36.2 | 107.95,36.2 C18.1 | 107.95,36.2 v107.95,36.83 | v97.79,37.47 98.42,36.83 100.48,36.83 100.5,36.85 100.91,36.85 IC2.3 | IC2.11 102.85,33.6 102.85,33.19 102.87,33.17 102.87,31.11 v102.23,30.48
  Bottom 0.203: v97.79,37.47 98.42,36.83 102.87,36.83 | v107.95,36.83 102.87,36.83 | v102.23,30.48 102.87,31.11 102.87,36.83
CM_USB_N  (via drill 0.35)
  Top 0.254: U$3.15 51.15,76.35 52.27,77.47 55.24,77.47 v55.88,78.11
  Bottom 0.254: v55.88,78.11 55.88,89.53 U$1.5
CM_USB_P
  Top 0.254: U$3.16 50.51,76.35 52.04,77.88 54.38,77.88 56.51,80.01 56.51,88.9 U$1.7
ETH_N  (via drill 0.35)
  Top 0.254: U$3.10 48.59,68.43 48.71,68.31 48.71,66.24 v48.51,66.04 | IC2.5 96.77,35.95 95.25,37.47 95.25,38.1 93.98,39.37 v92.71,39.37
  Bottom 0.254: v48.51,66.04 48.51,65.22 49.36,64.36 79.78,64.36 93.34,50.8 93.34,40.64 92.71,40.01 v92.71,39.37
ETH_P  (via drill 0.35)
  Top 0.254: U$3.11 49.23,68.43 49.11,68.31 49.11,66.24 v49.31,66.04 | IC2.6 96.7,35.45 94.96,37.18 94.9,37.18 v93.98,38.1
  Bottom 0.254: v49.31,66.04 49.31,64.99 49.53,64.77 79.95,64.77 93.75,50.97 93.75,38.33 v93.98,38.1
GND  (via drill 0.35)
  Top 0.203: IC2.12 103.26,35.95 IC2.33 | IC2.4 103.26,36.45 IC2.33 | IC2.21 105.91,36.35 105.5,36.35 105.35,36.2 IC2.33 | IC2.28 103.76,36.45 IC2.33
  other vias: 48.89,84.45 99.06,118.75 106.68,119.7 101.6,22.23 12.7,29.21 12.7,27.94 12.7,26.67 12.7,25.4 12.7,43.81 12.7,45.09 12.7,46.35 12.7,47.62 107.63,38.73 103.82,40.32 107.63,33.02 100.97,29.84 91.12,126.36 92.39,122.87 94.93,123.19 94.62,117.16 99.38,109.22 86.68,107.31 86.68,119.7
  pour Top: -3.17,-1.27 -3.17,133.35 4.45,140.97 133.35,140.97 144.78,129.54 144.78,9.53 130.81,-4.45 -0.64,-4.45 -3.17,-1.91
  pour Bottom: -2.54,-1.27 -2.54,133.99 5.08,141.6 133.98,141.6 145.41,130.18 145.41,10.16 132.08,-3.17 -0.64,-3.17
GPIO2
  Bottom 0.254: U$1.56 119.38,92.71 120.02,92.08 120.02,88.27 126.37,81.92 126.37,40.01 125.73,39.37 125.09,39.37 124.46,38.73 124.46,35.56 123.83,34.92 JP1.3
GPIO3
  Top 0.254: U$1.55 118.75,88.9 120.02,87.63 120.65,87.63 126.37,81.92 126.37,40.01 127,39.37 127,36.2 JP1.5
GPIO25  (via drill 0.35)
  Top 0.254: U$1.16 66.67,91.44 66.67,85.72 66.04,85.09 66.04,61.7 59.69,55.35 v59.69,55.24 | v57.15,14.61 R10.2
  Bottom 0.254: v59.69,55.24 59.69,17.89 57.73,15.93 57.41,15.61 57.15,15.35 v57.15,14.61
GPIO26  (via drill 0.35)
  Top 0.254: U$1.14 64.14,91.44 64.14,85.72 64.77,85.09 64.77,62.23 58.42,55.88 v58.42,55.24
  Bottom 0.254: v58.42,55.24 58.42,18.41 55.88,15.88 55.88,4.76 SW1.1
GPS_PPS  (via drill 0.35)
  Top 0.305: X1.19 98.44,116.51 98.74,116.2 v98.74,115.25 | v109.86,114.62 133.35,114.62 U$2.5
  Bottom 0.305: v98.74,115.25 99.38,114.62 v109.86,114.62
GPS_RX  (via drill 0.35)
  Top 0.305: X1.33 95.44,122.11 94.62,121.28 94.62,118.75 93.98,118.11 93.98,100.97 99.7,95.25 99.7,91.44 U$1.39 | U$2.3 110.81,109.22 105.41,103.82 102.23,103.82 v101.92,103.5
  Bottom 0.305: v101.92,103.5 99.7,101.28 99.7,91.44 U$1.39
GPS_TX
  Top 0.305: X1.31 99.04,121.31 100.33,120.02 100.33,105.09 | U$1.41 102.23,91.44 102.23,94.93 100.33,96.84 100.33,105.09 | 100.33,105.09 103.51,108.27 107,108.27 110.49,111.76 U$2.4
LED1-
  Top 0.254: J2.11 110.44,5.08 110.81,5.08 116.2,10.48 R21.2
LED2-
  Top 0.254: R12.1 92.71,9.53 97.79,4.45 98.74,4.45 100.05,3.14 J2.10
LORA_RS1  (via drill 0.35)
  Top 0.305: X1.22 88.42,117.52 87.48,117.52 87.44,117.47 v85.09,117.47
  Bottom 0.305: U$1.29 84.45,91.44 84.45,116.84 v85.09,117.47
N$3
  Top 0.203: J2.4 103.54,12.73 102.55,11.75 99.06,11.75 97.16,13.65 96.84,13.65 95.57,14.92 95.57,19.05 94.51,20.11 C7.2
N$4
  Top 0.254: C9.2 113.67,20.11 112.08,18.52 112.08,14.92 108.9,11.75 105.09,11.75 104.81,12.04 J2.5
N$5
  Top 0.305: D3.A 24.47,6.69 25.4,7.62 C11.1
  Top 0.61: CN1.PWR1 23.18,2.22 22.23,3.17 D3.A
N$6
  Top 0.254: LED3.4 44.45,5.08 43.18,6.35 43.18,11.43 44.66,12.91 R11.1
N$7
  Top 0.305: R1.2 LED1.C
N$8
  Top 0.254: LED3.2 46.99,8.89 46.99,13.34 48.26,14.61 R10.1
N$10
  Top 0.406: U1.2 24.13,45.09 27.94,41.27 31.93,41.27 L1.1 35.38,40.82 36.83,39.37 D1.C
N$11
  Top 0.254: U$3.21 47.31,73.97 48.26,73.03 50.16,73.03 50.51,72.68 U$3.13 50.51,67.6 53.34,64.77 C12.2 C13.2
N$12
  Top 0.254: U$3.12 49.87,71.42 49.33,71.96 48.08,71.96 47.01,73.03 45.72,73.03 45.08,73.66 43.18,73.66 42.83,74.01 U$3.28
  Top 0.305: U$3.28 42.83,76.55 42.54,76.83 41.27,76.83 37.46,80.64 | 37.46,80.64 C14.2 | C15.2 37.04,81.06 37.46,80.64
N$13
  Top 0.305: LED2.C R8.2
N$14
  Top 0.406: U2.2 24.13,26.67 27.3,23.5 32.2,23.5 L2.1 35.38,23.68 36.2,22.86 D2.C
N$19
  Top 0.305: U$3.26 44.11,77.81 43.81,78.11 42.54,78.11 40.64,80.01 R5.2
N$20
  Top 0.254: U$3.14 51.15,68.86 51.43,68.58 57.57,68.58 R2.2
N$21
  Top 0.305: U$3.19 48.59,78.41 46.99,80.01 44.45,80.01 43.81,80.64 R4.2
N$22
  Top 0.305: U$3.18 49.23,80.13 R7.1 R6.1
N$24
  Top 0.305: U$3.17 49.87,78.44 51.43,80.01 52.28,80.01 R3.2
N$25
  Top 0.305: U$3.2 43.47,63.79 41.91,62.23 41.91,60.96 40.64,59.69 Y2.2
N$26
  Top 0.305: U$3.3 44.11,63.84 46.35,61.59 46.99,61.59 48.01,60.58 Y2.1
N$27
  Top 0.254: IC2.19 108.06,35.45 118.11,25.4 118.11,19.27 R21.1
N$37
  Top 0.203: IC2.10 102.26,32.33 100.54,30.61 94.41,30.61 92,33.02 88.9,33.02 88.27,32.38 Y3.1 86.74,26.67 C23.2 82.13,32.59 R25.1
N$39
  Top 0.203: IC2.9 101.76,32.54 100.33,31.11 94.62,31.11 92.21,33.52 88.9,33.52 88.27,34.16 Y3.2 86.74,39.37 C22.2 82.13,34.72 R25.2
N$40  (via drill 0.35)
  Top 0.203: 100.97,34.41 99.7,33.13 v99.7,33.02 | v93.98,16.51 93.98,17.14 93.77,17.36 R12.2
  Top 0.254: IC2.8 100.97,34.41
  Bottom 0.203: v99.7,33.02 99.7,30.48 92.71,23.5 92.71,17.14 93.34,16.51 v93.98,16.51
N$47
  Top 0.254: IC2.2 99.72,37.45 97.37,39.79 R24.1
N$48
  Top 0.254: IC2.1 100.48,37.95 99.06,39.37 99.06,42.55 98.42,43.18 C21.2 R22.1 R23.1
RD+
  Top 0.203: IC2.15 104.76,24.75 102.23,22.23 102.23,17.23
  Top 0.254: J2.3 102.23,17.23
RD-
  Top 0.203: IC2.16 105.26,32.54 106.05,31.75 106.05,19.77 J2.6
SPI1_CE2  (via drill 0.35)
  Top 0.305: X1.51 98.83,129.31 99.06,129.54 v99.7,129.54
  Bottom 0.305: U$1.34 90.81,123.83 93.34,126.36 105.41,126.36 106.05,127 106.05,128.27 104.78,129.54 v99.7,129.54
SPI1_MISO  (via drill 0.35)
  Top 0.305: v102.23,127.64 99.06,127.64 98.98,127.71 X1.47
  Bottom 0.305: U$1.28 83.19,124.46 86.36,127.64 v102.23,127.64
SPI1_MOSI  (via drill 0.35)
  Top 0.305: X1.49 94.38,128.51 v93.98,128.91
  Bottom 0.305: U$1.26 80.65,125.73 83.19,128.27 93.34,128.27 v93.98,128.91
SPI1_SCLK  (via drill 0.35)
  Top 0.305: X1.45 96.9,127 104.14,127 104.78,127.64 104.78,130.81 102.87,132.72 v99.06,132.72
  Bottom 0.305: U$1.24 78.11,128.91 81.92,132.72 v99.06,132.72
TD+  (via drill 0.35)
  Top 0.203: v103.51,26.67 103.51,29.21 104.26,29.96 IC2.14
  Bottom 0.203: v103.51,26.67 103.51,25.4 99.06,20.95 99.06,14.87 J2.1
TD-
  Top 0.203: IC2.13 103.76,30.09 102.87,29.21 102.87,26.04 101,24.16 J2.2
USB1_N  (via drill 0.35)
  Top 0.254: U$3.8 47.31,67.63 46.99,67.31 v45.72,67.31
  Bottom 0.254: v45.72,67.31 45.52,67.11 23.99,67.11 23.55,66.67 22.23,66.67 21.23,67.67 J3.2
USB1_P  (via drill 0.35)
  Top 0.254: U$3.9 47.95,67.69 46.76,66.5 v45.72,66.5
  Bottom 0.254: v45.72,66.5 45.52,66.7 24.16,66.7 23.72,66.27 21.82,66.27 21.23,65.67 J3.3
USB2_N
  Top 0.254: U$3.6 46.03,70.95 45.22,71.75 29.91,71.75 25.63,76.03 25.63,90.81 24.99,91.44 22.05,91.44 J1.2
USB2_P  (via drill 0.35)
  Top 0.254: U$3.7 46.67,70.95 45.46,72.16 30.07,72.16 26.04,76.2 26.04,90.97 24.3,92.71 v22.23,92.71
  Bottom 0.254: v22.23,92.71 20.59,91.08 J1.3
(copper drawn outside any net)
  shapes: Top area x1

### Text on the board
tNames: Nebra Smart Indoors Gateway | LORA MODULE | Designed in the United Kingdom | Smart Indoor / LoRa Gateway | https://nebra.io/iot | USB1 | USB2 | KEY | V12-15-2020-1614 | LORA | GPS